# Altium project pca20017.PrjPCB
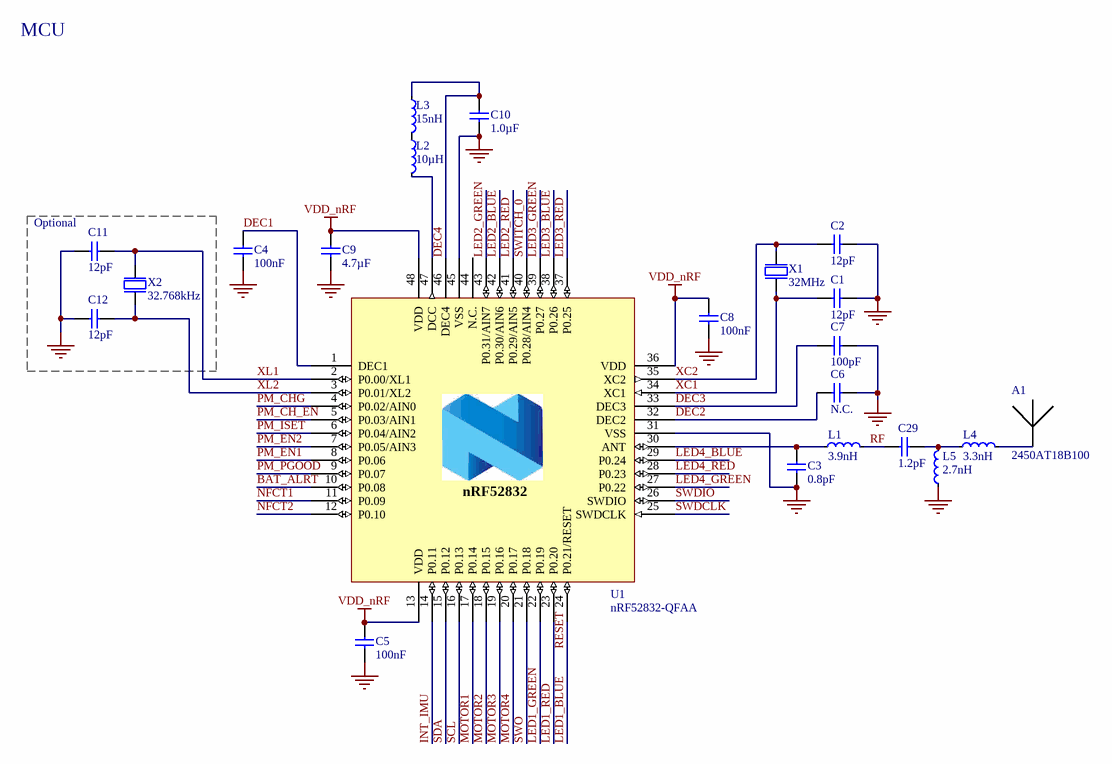
[diagram p0: pca20017_mcu.SchDoc]
5 sheets, 144 parts. Net scope: global (net labels, ports and power ports of the same name join across sheets).
Board file: 400151.PcbDoc
Sheets:
  pca20017_mcu.SchDoc
  pca20017_misc.SchDoc
  pca20017_sensors.SchDoc
  pca20017_power.SchDoc
  pca20017_motors.SchDoc

## Sheet pca20017_mcu.SchDoc: nRF52 Quadcopter - MCU
size A4; Organization: Nordic Semiconductor; DocumentNumber: 1; Revision: 1.0.0; SheetNumber: 1; SheetTotal: 5; CompanyName: Nordic Semiconductor; DrawnBy: ERHE; ProjectNumber: 4425; DocumentSize: A4; PCBRevision: 0002ERHE; PCAName: PCA20017; PCBNumber: 400151; Rule: PcbType=ProtelPcb

### Parts
A1  2450AT18B100  [2450AT18B100]
C1  12pF  [CAPC1005X04L]
C2  12pF  [CAPC1005X04L]
C3  0.8pF  [CAPC1005X04L]
C4  100nF  [CAPC1005X04L]
C5  100nF  [CAPC1005X04L]
C6  N.C.  [CAPC1005X04L]
C7  100pF  [CAPC1005X04L]
C8  100nF  [CAPC1005X04L]
C9  4.7µF  [CAPC1608X06L]
C10  1.0µF  [CAPC1608X06L]
C11  12pF  [CAPC1005X04L]
C12  12pF  [CAPC1005X04L]
C29  1.2pF  [CAPC1005X04L]
L1  3.9nH  [INDC1005X04L]
L2  10µH  [INDC1608X06L]
L3  15nH  [INDC1005X04L]
L4  3.3nH  [INDC1005X04L]
L5  2.7nH  [INDC1005X04L]
U1  nRF52832-QFAA  [QFN40P600X600X90-48N]
X1  32MHz  [BT-XTAL_2016]
X2  32.768kHz  [XTAL_3215]

### Nets
GND: C1.2 C2.2 C3.1 C4.2 C5.2 C6.1 C7.2 C8.2 C9.2 C10.1 C11.2 C12.2 L5.1 U1.31(VSS) U1.45(VSS) U1.49(GND) X1.2(GND) X1.4(GND)
VDD_nRF: C5.1 C8.1 C9.1 U1.13(VDD) U1.36(VDD) U1.48(VDD)
BAT_ALRT: U1.10(P0.08)
DEC1: C4.1 U1.1(DEC1)
DEC2: C6.2 U1.32(DEC2)
DEC3: C7.1 U1.33(DEC3)
DEC4: C10.2 L3.1 U1.46(DEC4)
INT_IMU: U1.14(P0.11)
LED1_BLUE: U1.24(P0.21/RESET)  [also labelled RESET]
LED1_GREEN: U1.22(P0.19)
LED1_RED: U1.23(P0.20)
LED2_BLUE: U1.42(P0.30/AIN6)
LED2_GREEN: U1.43(P0.31/AIN7)
LED2_RED: U1.41(P0.29/AIN5)
LED3_BLUE: U1.38(P0.26)
LED3_GREEN: U1.39(P0.27)
LED3_RED: U1.37(P0.25)
LED4_BLUE: U1.29(P0.24)
LED4_GREEN: U1.27(P0.22)
LED4_RED: U1.28(P0.23)
MOTOR1: U1.17(P0.14)
MOTOR2: U1.18(P0.15)
MOTOR3: U1.19(P0.16)
MOTOR4: U1.20(P0.17)
NFCT1: U1.11(P0.09)  [project net NFC1]
NFCT2: U1.12(P0.10)  [project net NFC2]
PM_CH_EN: U1.5(P0.03/AIN1)
PM_CHG: U1.4(P0.02/AIN0)
PM_EN1: U1.8(P0.06)
PM_EN2: U1.7(P0.05/AIN3)
PM_ISET: U1.6(P0.04/AIN2)
PM_PGOOD: U1.9(P0.07)
RF: C29.1 L1.2
SCL: U1.16(P0.13)
SDA: U1.15(P0.12)
SWDCLK: U1.25(SWDCLK)
SWDIO: U1.26(SWDIO)
SWITCH_0: U1.40(P0.28/AIN4)
SWO: U1.21(P0.18)
XC1: C1.1 U1.34(XC1) X1.1(inp)
XC2: C2.1 U1.35(XC2) X1.3(out)
XL1: C11.1 U1.2(P0.00/XL1) X2.1(inp)
XL2: C12.1 U1.3(P0.01/XL2) X2.2(out)
NetA1_1: A1.1 L4.2
NetC3_2: C3.2 L1.1 U1.30(ANT)
NetC29_2: C29.2 L4.1 L5.2
NetL2_1: L2.1 L3.2
NetL2_2: L2.2 U1.47(DCC)

Not connected (* = marked no-connect by the designer): U1 44(N.C.)

### Notes on the sheet
- MCU
- (near C11) Optional
- Title
- Size
- Date:
- Project Number
- Sheet         of
- Revision
- File:
- Drawn By:
- (in symbol nRF52832-QFAA) nRF52832

### Library data of the parts
A1 = Johanson 2450AT18B100: 2.45 GHz chip antenna; Manufacturer: Johanson Technology; Artikkelnr Noca: N.A.; Part Number: Johanson 2450AT18B100; Manufacturer Part Number: 2450AT18B100; Datasheet: http://www.johansontechnology.com/datasheets/antennas/2450AT18B100.pdf; Footprint Doc: 2450AT18B100; LatestRevisionDate: 2013-09-13; Pin Count: 2; Publisher: Nordic Semiconductor; Published: 2013-09-13; Value: 2450AT18B100; Note: *; Supplier: Digi-Key; Supplier part number: 712-1006-1-ND; 2nd source Supplier: *; 2nd source part number: *; Artikkelnr Simpro: N.A.
C1 C2 C11 C12 = C0402-12p: Capacitor, NP0, ±2%; Note: 50V; Artikkelnr Noca: 20029159; Artikkelnr Simpro: N.A.; Part Number: C0402-12p; Manufacturer: *; Manufacturer Part Number: *; Datasheet: *; LatestRevisionDate: 2011-05-11; Pin Count: 2; Publisher: Nordic Semiconductor; Published: 2009-05-08; Value: 12pF; Supplier: *; Supplier part number: *; 2nd source Supplier: *; 2nd source part number: *; Footprint Doc: 0402
C3 = C0402-0.8p: Capacitor, NP0, ±5%; Note: 50V; Artikkelnr Noca: 20029147; Artikkelnr Simpro: N.A.; Part Number: C0402-0.8p; Manufacturer: *; Manufacturer Part Number: *; Datasheet: *; LatestRevisionDate: 2012-11-21; Pin Count: 2; Publisher: Nordic Semiconductor; Published: 2009-05-08; Value: 0.8pF; Supplier: *; Supplier part number: *; 2nd source Supplier: *; 2nd source part number: *; Footprint Doc: 0402
C4 C5 C8 = C0402-100n: Capacitor, X7R, ±10%; Note: 16V; Artikkelnr Noca: 20039200; Artikkelnr Simpro: N.A.; Part Number: C0402-100n; Manufacturer: *; Manufacturer Part Number: *; Datasheet: *; LatestRevisionDate: 2009-11-23; Pin Count: 2; Publisher: Nordic Semiconductor; Published: 2009-05-08; Value: 100nF; Supplier: *; Supplier part number: *; 2nd source Supplier: *; 2nd source part number: *; Footprint Doc: 0402
C6 = C0402-N.C.: Not mounted; Note: Chip Cap; Artikkelnr Noca: N.A.; Assembly: Not mounted; Part Number: C0402-N.C.; Manufacturer: *; Manufacturer Part Number: *; Datasheet: *; LatestRevisionDate: 2009-05-08; Pin Count: 2; Publisher: Nordic Semiconductor; Published: 2009-05-08; Value: N.C.; Supplier: *; Supplier part number: *; 2nd source Supplier: *; 2nd source part number: *; Footprint Doc: 0402; Artikkelnr Simpro: N.A.
C7 = C0402-100p: Capacitor, NP0, ±5%; Note: 50V; Artikkelnr Noca: 20029135; Artikkelnr Simpro: N.A.; Part Number: C0402-100p; Manufacturer: *; Manufacturer Part Number: *; Datasheet: *; LatestRevisionDate: 2009-05-08; Pin Count: 2; Publisher: Nordic Semiconductor; Published: 2009-05-08; Value: 100pF; Supplier: *; Supplier part number: *; 2nd source Supplier: *; 2nd source part number: *; Footprint Doc: 0402
C9 = C0603-4µ7: Capacitor, X5R, ±10%; Note: 6.3V; Artikkelnr Noca: 20069060; Artikkelnr Simpro: N.A.; Part Number: C0603-4µ7; Manufacturer: *; Manufacturer Part Number: *; Datasheet: *; LatestRevisionDate: 2009-11-23; Pin Count: 2; Publisher: Nordic Semiconductor; Published: 2009-05-08; Value: 4.7µF; Supplier: *; Supplier part number: *; 2nd source Supplier: *; 2nd source part number: *; Footprint Doc: 0603
C10 = C0603-1µ0: Capacitor, X7R, ±10%; Note: 16V; Artikkelnr Noca: 20039335; Artikkelnr Simpro: N.A.; Part Number: C0603-1µ0; Manufacturer: *; Manufacturer Part Number: *; Datasheet: *; LatestRevisionDate: 2013-06-05; Pin Count: 2; Publisher: Nordic Semiconductor; Published: 2009-05-08; Value: 1.0µF; Supplier: *; Supplier part number: *; 2nd source Supplier: *; 2nd source part number: *; Footprint Doc: 0603
C29 = C0402-1.2p: Capacitor, NP0, ±0.1pF; Note: 50V; Artikkelnr Noca: 20029157; Artikkelnr Simpro: N.A.; Part Number: C0402-1.2p; Manufacturer: *; Manufacturer Part Number: *; Datasheet: *; Footprint Doc: 0402; LatestRevisionDate: 2011-05-11; Pin Count: 2; Publisher: Nordic Semiconductor; Published: 2009-05-08; Value: 1.2pF; Supplier: *; Supplier part number: *; 2nd source Supplier: *; 2nd source part number: *
L1 = L0402-3n9: Inductor, 170mA, ±0.1nH; Manufacturer: Murata; Manufacturer Part Number: LQP15MN3N9B02D; Note: High frequency chip inductor ±5%; Artikkelnr Noca: 33029151; Artikkelnr Simpro: N.A.; Part Number: L0402-3n9; Datasheet: http://search.murata.co.jp/Ceramy/image/img/PDF/ENG/L0075S0084LQP15M.pdf; LatestRevisionDate: 2012-09-19; Pin Count: 2; Publisher: Nordic Semiconductor; Published: 2009-05-08; Value: 3.9nH; Supplier: Digi-Key; Supplier part number: 490-1131-1-ND; 2nd source Supplier: *; 2nd source part number: *; Footprint Doc: 0402
L2 = L0603-10µ: Inductor, 80mA, ±10%; Manufacturer: Taiyo Yuden; Manufacturer Part Number: LBMF1608T100K; 2nd source part number: 178-6105; Note: LBMF1608T100K 10µH 80mA 0603; Artikkelnr Noca: 33029314; Artikkelnr Simpro: N.A.; Part Number: L0603-10µ; Datasheet: http://www.yuden.co.jp/ut/product/pdf/elb2_e.pdf; LatestRevisionDate: 2012-09-19; Pin Count: 2; Publisher: Nordic Semiconductor; Published: 2010-02-24; Value: 10µH; Supplier: Digi-Key; Supplier part number: 587-1714-1-ND; 2nd source Supplier: Farnell; Footprint Doc: 0603
L3 = L0402-15n: Inductor, 320mA, ±5%; Manufacturer: Taiyo Yuden; Manufacturer Part Number: HK100515NJ-T; 2nd source part number: 658-1328; Note: High frequency chip inductor ±10%; Artikkelnr Noca: 33029323; Artikkelnr Simpro: N.A.; Part Number: L0402-15n; LatestRevisionDate: 2012-09-19; Pin Count: 2; Publisher: Nordic Semiconductor; Published: 2010-07-12; Value: 15nH; Supplier: Digi-Key; Datasheet: http://www.yuden.co.jp/productdata/catalog/en/mlci04_e.pdf; Supplier part number: 587-1521-1-ND; 2nd source Supplier: Farnell; Footprint Doc: 0402
L4 = L0402-3n3: Inductor, 190mA, ±0.1nH; Manufacturer: Murata; Manufacturer Part Number: LQP15MN3N3B02D; Note: High frequency chip inductor ±5%; Artikkelnr Noca: 33029369; Artikkelnr Simpro: N.A.; Part Number: L0402-3n3; Datasheet: http://search.murata.co.jp/Ceramy/image/img/PDF/ENG/L0075S0084LQP15M.pdf; Footprint Doc: 0402; LatestRevisionDate: 2012-09-19; Pin Count: 2; Publisher: Nordic Semiconductor; Published: 2009-05-08; Value: 3.3nH; Supplier: Digi-Key; Supplier part number: 490-1130-1-ND; 2nd source Supplier: *; 2nd source part number: *
L5 = L0402-2n7: Inductor, 220mA, ±0.1nH; Manufacturer: Murata; Manufacturer Part Number: LQP15MN2N7B02D; Note: High frequency chip inductor ±5%; Artikkelnr Noca: 33029150; Artikkelnr Simpro: N.A.; Part Number: L0402-2n7; Datasheet: http://search.murata.co.jp/Ceramy/image/img/PDF/ENG/L0075S0084LQP15M.pdf; Footprint Doc: 0402; LatestRevisionDate: 2012-09-19; Pin Count: 2; Publisher: Nordic Semiconductor; Published: 2009-05-08; Value: 2.7nH; Supplier: Digi-Key; Supplier part number: 490-1129-1-ND; 2nd source Supplier: *; 2nd source part number: *
U1 = nRF52832-QFAA: Multi-protocol Bluetooth Low Energy, ANT and 2.4GHz proprietary system-on-chip; Manufacturer: Nordic Semiconductor; Artikkelnr Noca: 15079306; Artikkelnr Simpro: N.A.; Part Number: nRF52832-QFAA; Manufacturer Part Number: nRF52832-QFAA; Datasheet: *; LatestRevisionDate: 2016-06-02; Pin Count: 48; Publisher: Nordic Semiconductor; Published: 2014-11-26; Value: nRF52832-QFAA; Note: *; Supplier: Nordic Semiconductor; Supplier part number: *; 2nd source Supplier: *; 2nd source part number: *; Footprint Doc: QFN-48
X1 = XTAL_SMD2016_32MHz_8pF_Kyocera: XTAL SMD 2016, 32MHz, Cl=8pF, Tot: ±40ppm; Manufacturer Part Number: CX2016DB32000D0WZRC1; Note: XTAL SMD 32.000MHz; Artikkelnr Noca: 22010022; Artikkelnr Simpro: N.A.; Part Number: XTAL_SMD2016_32MHz_8pF_Kyocera; Manufacturer: Kyocera; Datasheet: http://media.digikey.com/pdf/Data%20Sheets/AVX%20PDFs/CX2016DB32000D0WZRC1_Spec.pdf; LatestRevisionDate: 2016-06-02; Pin Count: 4; Publisher: Nordic Semiconductor; Published: 2015-10-15; Value: 32MHz; Supplier: Digi-Key; Supplier part number: 1253-1586-1-ND; 2nd source Supplier: *; 2nd source part number: *; Footprint Doc: XTAL_2016
X2 = XTAL_SMD3215_32.768kHz_9pF_Seiko: XTAL SMD 2012, 32.768kHz, 9pF, ±20ppm; Manufacturer: Seiko; Manufacturer Part Number: SC32S-9.0PF20PPM; Note: XTAL SMD 32.768kHz, 3215; Artikkelnr Noca: N.A.; Part Number: XTAL_SMD3215_32.768kHz_9pF_Seiko; Datasheet: http://www.sii.co.jp/en/quartz/files/2013/03/file_PRODUCT_MASTER_50812_GRAPHIC03.pdf; LatestRevisionDate: 2015-10-15; Pin Count: 2; Publisher: Nordic Semiconductor; Published: 2015-10-15; Value: 32.768kHz; Supplier: *; Supplier part number: *; 2nd source Supplier: *; 2nd source part number: *; Footprint Doc: XTAL_3215; Artikkelnr Simpro: N.A.

## Sheet pca20017_misc.SchDoc: nRF52 Quadcopter - Misc
size A4; Organization: Nordic Semiconductor; DocumentNumber: 2; Revision: 1.0.0; SheetNumber: 2; SheetTotal: 5; CompanyName: Nordic Semiconductor; DrawnBy: ERHE; ProjectNumber: 4425; DocumentSize: A4; PCBRevision: 0002ERHE; PCAName: PCA20017; PCBNumber: 400151; Rule: PcbType=ProtelPcb
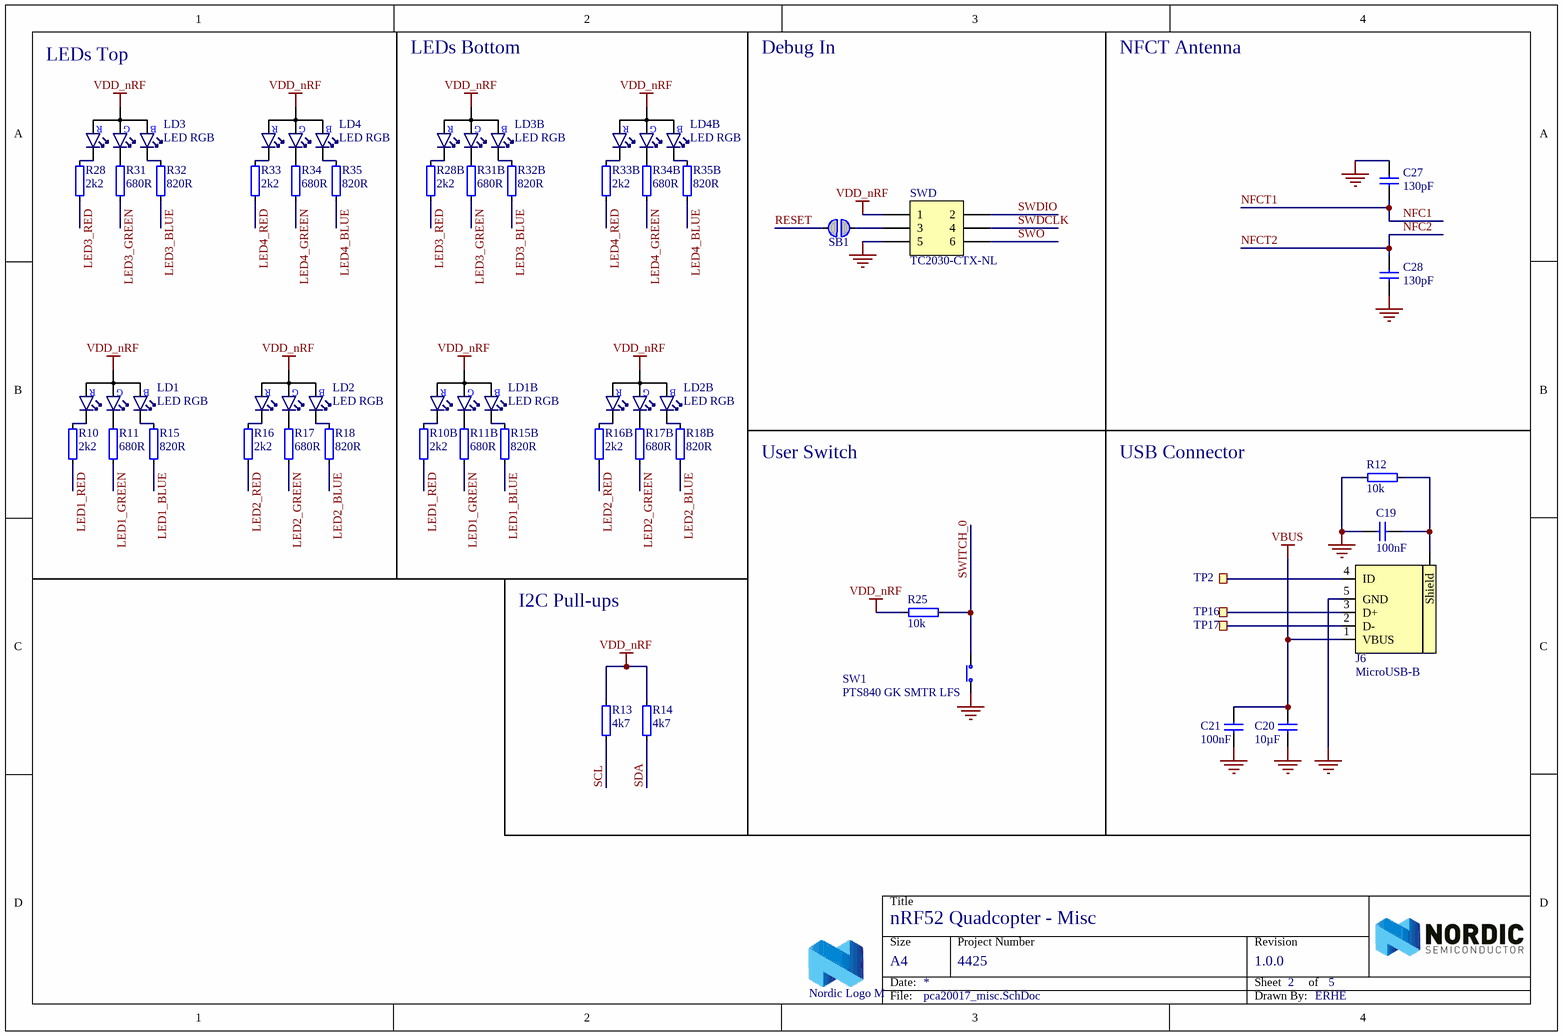
[diagram p1: pca20017_misc.SchDoc]

### Parts
C19  100nF  [CAPC1005X04L]
C20  10µF  [CAPC1608X06L]
C21  100nF  [CAPC1005X04L]
C27  130pF  [CAPC1005X04L]
C28  130pF  [CAPC1005X04L]
J6  MicroUSB-B  [USB-Micro-B-RA-SMD-PiP]
LD1  LED RGB  [SML-LX0404SIUPGUSB]
LD1B  LED RGB  [SML-LX0404SIUPGUSB]
LD2  LED RGB  [SML-LX0404SIUPGUSB]
LD2B  LED RGB  [SML-LX0404SIUPGUSB]
LD3  LED RGB  [SML-LX0404SIUPGUSB]
LD3B  LED RGB  [SML-LX0404SIUPGUSB]
LD4  LED RGB  [SML-LX0404SIUPGUSB]
LD4B  LED RGB  [SML-LX0404SIUPGUSB]
LOGO1  Nordic Logo M  [NORDIC_LOGO_M]  (no BOM)
R10  2k2  [RESC1005X04L]
R10B  2k2  [RESC1005X04L]
R11  680R  [RESC1005X04L]
R11B  680R  [RESC1005X04L]
R12  10k  [RESC1005X04L]
R13  4k7  [RESC1005X04L]
R14  4k7  [RESC1005X04L]
R15  820R  [RESC1005X04L]
R15B  820R  [RESC1005X04L]
R16  2k2  [RESC1005X04L]
R16B  2k2  [RESC1005X04L]
R17  680R  [RESC1005X04L]
R17B  680R  [RESC1005X04L]
R18  820R  [RESC1005X04L]
R18B  820R  [RESC1005X04L]
R25  10k  [RESC1005X04L]
R28  2k2  [RESC1005X04L]
R28B  2k2  [RESC1005X04L]
R31  680R  [RESC1005X04L]
R31B  680R  [RESC1005X04L]
R32  820R  [RESC1005X04L]
R32B  820R  [RESC1005X04L]
R33  2k2  [RESC1005X04L]
R33B  2k2  [RESC1005X04L]
R34  680R  [RESC1005X04L]
R34B  680R  [RESC1005X04L]
R35  820R  [RESC1005X04L]
R35B  820R  [RESC1005X04L]
SB1  Solderbridge  [Solderbridge]  (value not drawn)  (no BOM)
SW1  PTS840 GK SMTR LFS  [EVQP7A/J/B/K]
SWD  TC2030-CTX-NL  [TC2030-IDC-NLFP]  (no BOM)
TP2  Ø1.0mm,SMD  [TP_SMD_Ø1.0mm]  (value not drawn)  (no BOM)
TP16  Ø1.0mm,SMD  [TP_SMD_Ø1.0mm]  (value not drawn)  (no BOM)
TP17  Ø1.0mm,SMD  [TP_SMD_Ø1.0mm]  (value not drawn)  (no BOM)

### Nets
GND: C19.1 C20.1 C21.1 C27.2 C28.1 J6.5(GND) R12.1 SW1.2(COM) SWD.5
VBUS: C20.2 C21.2 J6.1(VBUS)
VDD_nRF: LD1.4(A) LD1B.4(A) LD2.4(A) LD2B.4(A) LD3.4(A) LD3B.4(A) LD4.4(A) LD4B.4(A) R13.2 R14.2 R25.1 SWD.1
LED1_BLUE: R15.1 R15B.1 SB1.2  [also labelled RESET]
LED1_GREEN: R11.1 R11B.1
LED1_RED: R10.1 R10B.1
LED2_BLUE: R18.1 R18B.1
LED2_GREEN: R17.1 R17B.1
LED2_RED: R16.1 R16B.1
LED3_BLUE: R32.1 R32B.1
LED3_GREEN: R31.1 R31B.1
LED3_RED: R28.1 R28B.1
LED4_BLUE: R35.1 R35B.1
LED4_GREEN: R34.1 R34B.1
LED4_RED: R33.1 R33B.1
NFC1: C27.1  [also labelled NFCT1]
NFC2: C28.2  [also labelled NFCT2]
SCL: R13.1
SDA: R14.1
SWDCLK: SWD.4
SWDIO: SWD.2
SWITCH_0: R25.2 SW1.1(N.O)
SWO: SWD.6
NetC19_2: C19.2 J6.6(Shield) R12.2
NetJ6_2: J6.2(D-) TP17.1
NetJ6_3: J6.3(D+) TP16.1
NetJ6_4: J6.4(ID) TP2.1
NetLD1_1: LD1.1(C_RED) R10.2
NetLD1_2: LD1.2(C_GREEN) R11.2
NetLD1_3: LD1.3(C_BLUE) R15.2
NetLD1B_1: LD1B.1(C_RED) R10B.2
NetLD1B_2: LD1B.2(C_GREEN) R11B.2
NetLD1B_3: LD1B.3(C_BLUE) R15B.2
NetLD2_1: LD2.1(C_RED) R16.2
NetLD2_2: LD2.2(C_GREEN) R17.2
NetLD2_3: LD2.3(C_BLUE) R18.2
NetLD2B_1: LD2B.1(C_RED) R16B.2
NetLD2B_2: LD2B.2(C_GREEN) R17B.2
NetLD2B_3: LD2B.3(C_BLUE) R18B.2
NetLD3_1: LD3.1(C_RED) R28.2
NetLD3_2: LD3.2(C_GREEN) R31.2
NetLD3_3: LD3.3(C_BLUE) R32.2
NetLD3B_1: LD3B.1(C_RED) R28B.2
NetLD3B_2: LD3B.2(C_GREEN) R31B.2
NetLD3B_3: LD3B.3(C_BLUE) R32B.2
NetLD4_1: LD4.1(C_RED) R33.2
NetLD4_2: LD4.2(C_GREEN) R34.2
NetLD4_3: LD4.3(C_BLUE) R35.2
NetLD4B_1: LD4B.1(C_RED) R33B.2
NetLD4B_2: LD4B.2(C_GREEN) R34B.2
NetLD4B_3: LD4B.3(C_BLUE) R35B.2
NetSB1_1: SB1.1 SWD.3

### Notes on the sheet
- LEDs Top
- LEDs Bottom
- Debug In
- NFCT Antenna
- User Switch
- USB Connector
- I2C Pull-ups
- Title
- Size
- Date:
- Project Number
- Sheet         of
- Revision
- File:
- Drawn By:
- (in symbol SML-LX0404SIUPGUSB) R; G; B

### Library data of the parts
C19 C21 = C0402-100n: as C4 on sheet pca20017_mcu; Part Number: C0402-100n; Manufacturer: *; Manufacturer Part Number: *; Datasheet: *; LatestRevisionDate: 2009-11-23; Pin Count: 2; Publisher: Nordic Semiconductor; Published: 2009-05-08; Value: 100nF; Supplier: *; Supplier part number: *; 2nd source Supplier: *; 2nd source part number: *; Footprint Doc: 0402
C20 = C0603-10µ: Capacitor, X5R, ±20%; Note: 6.3V; Artikkelnr Noca: 20039234; Artikkelnr Simpro: N.A.; Part Number: C0603-10µ; Manufacturer: *; Manufacturer Part Number: *; Datasheet: *; LatestRevisionDate: 2011-01-17; Pin Count: 2; Publisher: Nordic Semiconductor; Published: 2011-01-17; Value: 10µF; Supplier: *; Supplier part number: *; 2nd source Supplier: *; 2nd source part number: *; Footprint Doc: 0603
C27 C28 = C0402-130p: Chip Cap 0402; Note: Chip Cap 1%; Artikkelnr Noca: N.A.; Part Number: C0402-130p; Manufacturer: *; Manufacturer Part Number: *; Datasheet: *; Footprint Doc: 0402; LatestRevisionDate: 2015-04-24; Pin Count: 2; Publisher: Nordic Semiconductor; Published: 2015-04-24; Value: 130pF; Supplier: *; Supplier part number: *; 2nd source Supplier: *; 2nd source part number: *; Artikkelnr Simpro: N.A.
J6 = USB-Micro-B-RA-SMD-PiP: MicroUSB-B-SMT; Manufacturer: Allen Creations Corp.; Manufacturer Part Number: AJU55-BS2111-L; 2nd source part number: 609-4616-1-ND; Artikkelnr Noca: 55029020; Artikkelnr Simpro: N.A.; Part Number: USB-Micro-B-RA-SMD-PiP; Datasheet: \\hizz\pro\app9717\Datasheet\connectores\Allen Creations Corp\AJU-211.pdf; Footprint Doc: USB-Micro-B-RA-SMD-PiP; LatestRevisionDate: 2016-04-21; Pin Count: 5; Publisher: Nordic Semiconductor; Published: 2014-10-07; Value: MicroUSB-B; Note: *; Supplier: Cabcon; Supplier part number: AJU55-BS2111-L; 2nd source Supplier: Digi-Key
LD1 LD1B LD2 LD2B LD3 LD3B LD4 LD4B = SML-LX0404SIUPGUSB: RGB LED 1.00 mm x 1.00 mm SMD; Manufacturer: Lumex; 2nd source part number: 211-8843; Artikkelnr Noca: 13019150; Artikkelnr Simpro: N.A.; Part Number: SML-LX0404SIUPGUSB; Manufacturer Part Number: SML-LX0404SIUPGUSB; Datasheet: http://media.digikey.com/pdf/Data%20Sheets/Lumex%20PDFs/SML-LX0404SIUPGUSB.pdf; Footprint Doc: SML-LX0404SIUPGUSB; LatestRevisionDate: 2012-10-08; Pin Count: 4; Publisher: Nordic Semiconductor; Published: 2012-10-08; Value: LED RGB; Note: *; Supplier: Digi-Key; Supplier part number: 67-2125-1-ND; 2nd source Supplier: Farnell
LOGO1 = Nordic Logo M: Nordic Logo, medium size; Artikkelnr Noca: N.A.; Part Number: Nordic Logo M; Manufacturer: *; Manufacturer Part Number: *; Datasheet: *; LatestRevisionDate: 2010-02-18; Publisher: Nordic Semiconductor; Value: Nordic Logo M; Note: *; Supplier: *; Supplier part number: *; 2nd source Supplier: *; 2nd source part number: *; Pin Count: 2; Published: 2010-02-18; Footprint Doc: NORDIC_LOGO_M; Artikkelnr Simpro: N.A.
R10 R10B R16 R16B R28 R28B R33 R33B = R0402-2k2: Resistor, ±1%, 0.063W; Note: Chip Res 1%; Artikkelnr Noca: 27049081; Artikkelnr Simpro: N.A.; Value Ohm: 2200; Part Number: R0402-2k2; Manufacturer: *; Manufacturer Part Number: *; Datasheet: *; Footprint Doc: 0402; LatestRevisionDate: 2009-11-23; Pin Count: 2; Publisher: Nordic Semiconductor; Published: 2009-05-08; Value: 2k2; Supplier: Farnell; Supplier part number: 173-8854; 2nd source Supplier: *; 2nd source part number: *
R11 R11B R17 R17B R31 R31B R34 R34B = R0402-680: Resistor, ±1%, 0.063W; Note: Chip Res 1%; Artikkelnr Noca: 27049069; Artikkelnr Simpro: N.A.; Value Ohm: 680; Part Number: R0402-680; Manufacturer: *; Manufacturer Part Number: *; Datasheet: *; Footprint Doc: 0402; LatestRevisionDate: 2009-11-23; Pin Count: 2; Publisher: Nordic Semiconductor; Published: 2009-05-08; Value: 680R; Supplier: Farnell; Supplier part number: 173-8848; 2nd source Supplier: *; 2nd source part number: *
R12 R25 = R0402-10k: Resistor, ±1%, 0.063W; Note: Chip Res 1%; Artikkelnr Noca: 27049097; Artikkelnr Simpro: N.A.; Value Ohm: 10000; Value: 10k; Part Number: R0402-10k; Manufacturer: *; Manufacturer Part Number: *; Datasheet: *; LatestRevisionDate: 2009-11-23; Pin Count: 2; Publisher: Nordic Semiconductor; Published: 2009-05-08; Supplier: Farnell; Supplier part number: 173-8864; 2nd source Supplier: *; 2nd source part number: *; Footprint Doc: 0402
R13 R14 = R0402-4k7: Resistor, ±1%, 0.063W; Note: Chip Res 1%; Artikkelnr Noca: 27049089; Artikkelnr Simpro: N.A.; Value Ohm: 4700; Part Number: R0402-4k7; Manufacturer: *; Manufacturer Part Number: *; Datasheet: *; Footprint Doc: 0402; LatestRevisionDate: 2009-11-23; Pin Count: 2; Publisher: Nordic Semiconductor; Published: 2009-05-08; Value: 4k7; Supplier: Farnell; Supplier part number: 173-8858; 2nd source Supplier: *; 2nd source part number: *
R15 R15B R18 R18B R32 R32B R35 R35B = R0402-820: Resistor, ±1%, 0.063W; Note: Chip Res 1%; Artikkelnr Noca: 27049071; Artikkelnr Simpro: N.A.; Value Ohm: 820; Part Number: R0402-820; Manufacturer: *; Manufacturer Part Number: *; Datasheet: *; Footprint Doc: 0402; LatestRevisionDate: 2009-11-23; Pin Count: 2; Publisher: Nordic Semiconductor; Published: 2009-05-08; Value: 820R; Supplier: Farnell; Supplier part number: 173-8849; 2nd source Supplier: *; 2nd source part number: *
SB1 = Solderbridge: Artikkelnr Noca: N.A.; Part Number: Solderbridge; Manufacturer: *; Manufacturer Part Number: *; Datasheet: *; Footprint Doc: Solderbridge; LatestRevisionDate: 2009-12-14; Pin Count: 2; Publisher: Nordic Semiconductor; Published: 2009-12-14; Value: Solderbridge; Note: *; Supplier: *; Supplier part number: *; 2nd source Supplier: *; 2nd source part number: *; Artikkelnr Simpro: N.A.
SW1 = PTS840 GK SMTR LFS: Microminiature SMT Switch, Side Actuated; Manufacturer: C & K; 2nd source part number: 611-PTS840GKSMTR; Note: Tactile Switch, SPST, SMD, 220gf; Artikkelnr Noca: 50019089; Artikkelnr Simpro: N.A.; Part Number: PTS840 GK SMTR LFS; Manufacturer Part Number: PTS840 GK SMTR LFS; Datasheet: http://www.ck-components.com/80185/pts840_11june13.pdf/; Footprint Doc: PTS840 Gx; LatestRevisionDate: 2014-09-17; Pin Count: 4; Publisher: Nordic Semiconductor; Published: 2014-08-12; Value: PTS840 GK SMTR LFS; Supplier: Digi-Key; Supplier part number: CKN10508CT-ND; 2nd source Supplier: Mouser
SWD = TC2030-CTX-NL: CBL PLUG-OF-NAILS 6-PIN; Manufacturer: Tag-Connect LLC; Artikkelnr Noca: N.A.; Part Number: TC2030-CTX-NL; Manufacturer Part Number: TC2030-CTX-NL; Datasheet: http://www.tag-connect.com/Materials/TC2030-IDC-NL.pdf; Footprint Doc: TC2030-IDC-NLFP; LatestRevisionDate: 2013-08-08; Pin Count: 6; Publisher: Nordic Semiconductor; Published: 2013-08-08; Value: TC2030-CTX-NL; Supplier: Tag-Connect; Supplier part number: TC2030-CTX-NL; 2nd source Supplier: *; 2nd source part number: *; Artikkelnr Simpro: N.A.
TP2 TP16 TP17 = TP_SMD_Ø1.0MM: 1.0mm circular SMD testpad; Manufacturer: Nordic Semiconductor; Artikkelnr Noca: N.A.; Part Number: TP_SMD_Ø1.0MM; Manufacturer Part Number: *; Datasheet: *; Footprint Doc: TP_SMD_Ø1.0mm; LatestRevisionDate: 2013-06-11; Pin Count: 1; Publisher: Nordic Semiconductor; Published: 2013-06-11; Value: Ø1.0mm,SMD; Note: *; Supplier: *; Supplier part number: *; 2nd source Supplier: *; 2nd source part number: *; Artikkelnr Simpro: N.A.

## Sheet pca20017_sensors.SchDoc: nRF52 Quadcopter - Sensors
size A4; Organization: Nordic Semiconductor; DocumentNumber: 3; Revision: 1.0.0; SheetNumber: 3; SheetTotal: 5; CompanyName: Nordic Semiconductor; DrawnBy: ERHE; ProjectNumber: 4425; DocumentSize: A4; PCAName: PCA20017; PCBRevision: 0002ERHE; PCBNumber: 400151; ProjectName: 4425
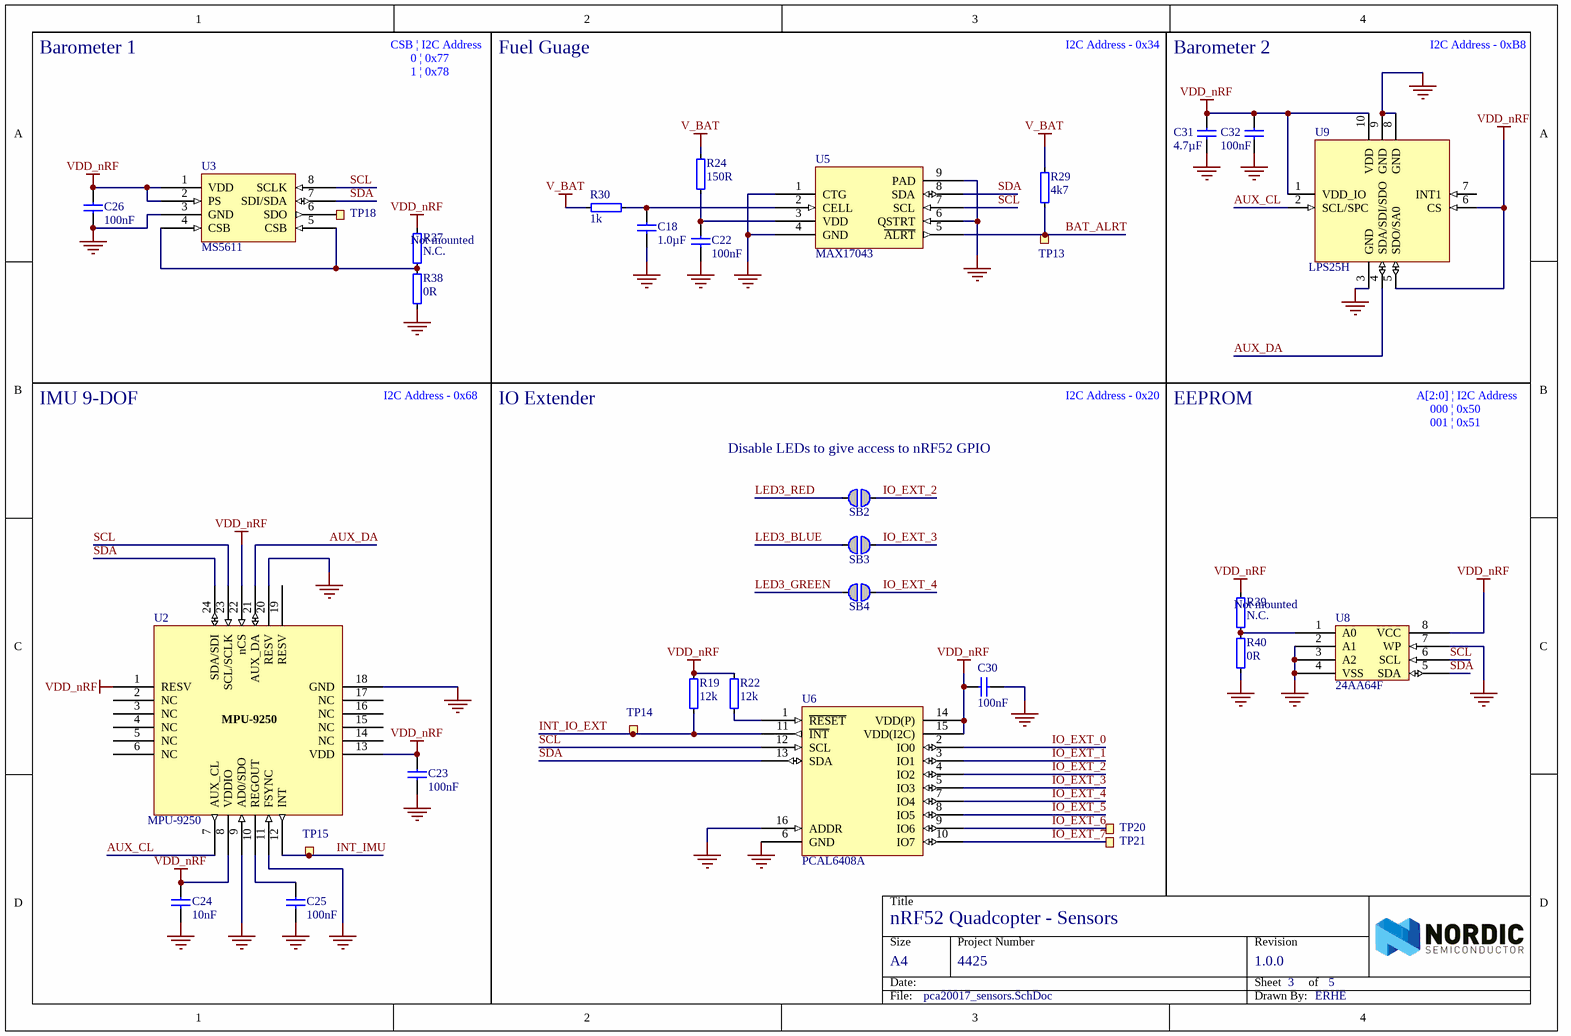
[diagram p2: pca20017_sensors.SchDoc]

### Parts
C18  1.0µF  [CAPC1005X04L]
C22  100nF  [CAPC1005X04L]
C23  100nF  [CAPC1005X04L]
C24  10nF  [CAPC1005X04L]
C25  100nF  [CAPC1005X04L]
C26  100nF  [CAPC1005X04L]
C30  100nF  [CAPC1005X04L]
C31  4.7µF  [CAPC1608X06L]
C32  100nF  [CAPC1005X04L]
R19  12k  [RESC1005X04L]
R22  12k  [RESC1005X04L]
R24  150R  [RESC1005X04L]
R29  4k7  [RESC1005X04L]
R30  1k  [RESC1005X04L]
R37  N.C.  Assembly: Not mounted  [RESC1005X04L]
R38  0R  [RESC1005X04L]
R39  N.C.  Assembly: Not mounted  [RESC1005X04L]
R40  0R  [RESC1005X04L]
SB2  Solderbridge  [Solderbridge]  (value not drawn)  (no BOM)
SB3  Solderbridge  [Solderbridge]  (value not drawn)  (no BOM)
SB4  Solderbridge  [Solderbridge]  (value not drawn)  (no BOM)
TP13  Ø1.0mm,SMD  [TP_SMD_Ø1.0mm]  (value not drawn)  (no BOM)
TP14  Ø1.0mm,SMD  [TP_SMD_Ø1.0mm]  (value not drawn)  (no BOM)
TP15  Ø1.0mm,SMD  [TP_SMD_Ø1.0mm]  (value not drawn)  (no BOM)
TP18  Ø1.0mm,SMD  [TP_SMD_Ø1.0mm]  (value not drawn)  (no BOM)
TP20  Ø1.0mm,SMD  [TP_SMD_Ø1.0mm]  (value not drawn)  (no BOM)
TP21  Ø1.0mm,SMD  [TP_SMD_Ø1.0mm]  (value not drawn)  (no BOM)
U2  MPU-9250  [QFN40P300X300X105_HS-25N]
U3  MS5611  [QFN125P300X500X100-8N]
U5  MAX17043  [MAX17043]
U6  PCAL6408A  [XQFN40P180X260X50-16N]
U8  24AA64F  [24AA64F]
U9  LPS25H  [HCLGA-10L (2.5x2.5x1.0mm)]

### Nets
GND: C18.1 C22.1 C23.1 C24.1 C25.1 C26.2 C30.1 C31.1 C32.1 R38.1 R40.1 U2.9(AD0/SDO) U2.11(FSYNC) U2.18(GND) U2.20(RESV) U3.3(GND) U5.1(CTG) U5.4(GND) U5.6(QSTRT) U5.9(PAD) U6.6(GND) U6.16(ADDR) U8.2(A1) U8.3(A2) U8.4(VSS) U8.7(WP) U9.3(GND) U9.8(GND) U9.9(GND)
V_BAT: R24.2 R29.2 R30.1
VDD_nRF: C23.2 C24.2 C26.1 C30.2 C31.2 C32.2 R19.2 R22.2 R37.2 R39.2 U2.1(RESV) U2.8(VDDIO) U2.13(VDD) U2.22(nCS) U3.1(VDD) U3.2(PS) U6.14(VDD(P)) U6.15(VDD(I2C)) U8.8(VCC) U9.1(VDD_IO) U9.5(SDO/SA0) U9.6(CS) U9.10(VDD)
AUX_CL: U2.7(AUX_CL) U9.2(SCL/SPC)
AUX_DA: U2.21(AUX_DA) U9.4(SDA/SDI/SDO)
BAT_ALRT: R29.1 TP13.1 U5.5(~{ALRT})
INT_IMU: TP15.1 U2.12(INT)
INT_IO_EXT: R19.1 TP14.1 U6.11(~{INT})
IO_EXT_0: U6.2(IO0)
IO_EXT_1: U6.3(IO1)
IO_EXT_2: SB2.2 U6.4(IO2)
IO_EXT_3: SB3.2 U6.5(IO3)
IO_EXT_4: SB4.2 U6.7(IO4)
IO_EXT_5: U6.8(IO5)
IO_EXT_6: TP20.1 U6.9(IO6)
IO_EXT_7: TP21.1 U6.10(IO7)
LED3_BLUE: SB3.1
LED3_GREEN: SB4.1
LED3_RED: SB2.1
SCL: U2.23(SCL/SCLK) U3.8(SCLK) U5.7(SCL) U6.12(SCL) U8.6(SCL)
SDA: U2.24(SDA/SDI) U3.7(SDI/SDA) U5.8(SDA) U6.13(SDA) U8.5(SDA)
NetC18_2: C18.2 R30.2 U5.2(CELL)
NetC22_2: C22.2 R24.1 U5.3(VDD)
NetC25_2: C25.2 U2.10(REGOUT)
NetR22_1: R22.1 U6.1(~{RESET})
NetR37_1: R37.1 R38.2 U3.4(CSB) U3.5(CSB)
NetR39_1: R39.1 R40.2 U8.1(A0)
NetTP18_1: TP18.1 U3.6(SDO)

Not connected (* = marked no-connect by the designer): U2 2(NC) 3(NC) 4(NC) 5(NC) 6(NC) 14(NC) 15(NC) 16(NC) 17(NC) 19(RESV); U9 7(INT1)

### Notes on the sheet
- Barometer 1
- CSB | I2C Address
- 0 | 0x77
- 1 | 0x78
- Fuel Guage
- I2C Address - 0x34
- Barometer 2
- I2C Address - 0xB8
- IMU 9-DOF
- I2C Address - 0x68
- IO Extender
- I2C Address - 0x20
- EEPROM
- A[2:0] | I2C Address
- 000 | 0x50
- 001 | 0x51
- (near SB2) Disable LEDs to give access to nRF52 GPIO
- Title
- Size
- Date:
- Project Number
- Sheet         of
- Revision
- File:
- Drawn By:

### Library data of the parts
C18 = C0402-1µ0: Capacitor, X5R, ±5%; Note: 6.3V; Artikkelnr Noca: 20039235; Artikkelnr Simpro: N.A.; Part Number: C0402-1µ0; Manufacturer: *; Manufacturer Part Number: *; Datasheet: *; Footprint Doc: 0402; LatestRevisionDate: 2009-11-23; Pin Count: 2; Publisher: Nordic Semiconductor; Published: 2009-05-08; Value: 1.0µF; Supplier: *; Supplier part number: *; 2nd source Supplier: *; 2nd source part number: *
C22 C23 C25 C26 C30 C32 = C0402-100n: as C4 on sheet pca20017_mcu; Part Number: C0402-100n; Manufacturer: *; Manufacturer Part Number: *; Datasheet: *; Footprint Doc: 0402; LatestRevisionDate: 2009-11-23; Pin Count: 2; Publisher: Nordic Semiconductor; Published: 2009-05-08; Value: 100nF; Supplier: *; Supplier part number: *; 2nd source Supplier: *; 2nd source part number: *
C24 = C0402-10n: Capacitor, X7R, ±10%; Note: 16V; Artikkelnr Noca: 20039166; Artikkelnr Simpro: N.A.; Part Number: C0402-10n; Manufacturer: *; Manufacturer Part Number: *; Datasheet: *; Footprint Doc: 0402; LatestRevisionDate: 2009-11-23; Pin Count: 2; Publisher: Nordic Semiconductor; Published: 2009-05-08; Value: 10nF; Supplier: *; Supplier part number: *; 2nd source Supplier: *; 2nd source part number: *
C31 = C0603-4µ7: as C9 on sheet pca20017_mcu; Part Number: C0603-4µ7; Manufacturer: *; Manufacturer Part Number: *; Datasheet: *; Footprint Doc: 0603; LatestRevisionDate: 2009-11-23; Pin Count: 2; Publisher: Nordic Semiconductor; Published: 2009-05-08; Value: 4.7µF; Supplier: *; Supplier part number: *; 2nd source Supplier: *; 2nd source part number: *
R19 R22 = R0402-12k: Resistor, ±1%, 0.063W; Note: Chip Res 1%; Artikkelnr Noca: 27049099; Artikkelnr Simpro: N.A.; Value Ohm: 12000; Part Number: R0402-12k; Manufacturer: *; Manufacturer Part Number: *; Datasheet: *; Footprint Doc: 0402; LatestRevisionDate: 2009-11-23; Pin Count: 2; Publisher: Nordic Semiconductor; Published: 2009-05-08; Value: 12k; Supplier: Farnell; Supplier part number: 173-8865; 2nd source Supplier: *; 2nd source part number: *
R24 = R0402-150: Resistor, ±1%, 0.063W; Note: Chip Res 1%; Artikkelnr Noca: 27049053; Artikkelnr Simpro: N.A.; Value Ohm: 150; Part Number: R0402-150; Manufacturer: *; Manufacturer Part Number: *; Datasheet: *; Footprint Doc: 0402; LatestRevisionDate: 2009-11-23; Pin Count: 2; Publisher: Nordic Semiconductor; Published: 2009-05-08; Value: 150R; Supplier: Farnell; Supplier part number: 173-8839; 2nd source Supplier: *; 2nd source part number: *
R29 = R0402-4k7: as R13 on sheet pca20017_misc; Part Number: R0402-4k7; Manufacturer: *; Manufacturer Part Number: *; Datasheet: *; Footprint Doc: 0402; LatestRevisionDate: 2009-11-23; Pin Count: 2; Publisher: Nordic Semiconductor; Published: 2009-05-08; Value: 4k7; Supplier: Farnell; Supplier part number: 173-8858; 2nd source Supplier: *; 2nd source part number: *
R30 = R0402-1k0: Resistor, ±1%, 0.063W; Note: Chip Res 1%; Artikkelnr Noca: 27049073; Artikkelnr Simpro: N.A.; Value Ohm: 1000; Part Number: R0402-1k0; Manufacturer: *; Manufacturer Part Number: *; Datasheet: *; Footprint Doc: 0402; LatestRevisionDate: 2009-11-23; Pin Count: 2; Publisher: Nordic Semiconductor; Published: 2009-05-08; Value: 1k; Supplier: Farnell; Supplier part number: 173-8850; 2nd source Supplier: *; 2nd source part number: *
R37 R39 = R0402-N.C.: Not mounted; Note: Chip Res; Artikkelnr Noca: N.A.; Part Number: R0402-N.C.; Manufacturer: *; Manufacturer Part Number: *; Datasheet: *; Footprint Doc: 0402; LatestRevisionDate: 2009-05-08; Pin Count: 2; Publisher: Nordic Semiconductor; Published: 2009-05-08; Value: N.C.; Supplier: *; Supplier part number: *; 2nd source Supplier: *; 2nd source part number: *; Artikkelnr Simpro: N.A.
R38 R40 = R0402-0R: Resistor, ±5%, 0.063W; Note: Chip Res 5%; Artikkelnr Noca: 27049000; Artikkelnr Simpro: N.A.; Value Ohm: 0; Part Number: R0402-0R; Manufacturer: *; Manufacturer Part Number: *; Datasheet: *; Footprint Doc: 0402; LatestRevisionDate: 2009-11-23; Pin Count: 2; Publisher: Nordic Semiconductor; Published: 2009-05-08; Value: 0R; Supplier: Farnell; Supplier part number: 146-9661; 2nd source Supplier: *; 2nd source part number: *
SB2-SB4 = Solderbridge: Artikkelnr Noca: N.A.; Part Number: Solderbridge; Manufacturer: *; Manufacturer Part Number: *; Datasheet: *; Footprint Doc: Solderbridge; LatestRevisionDate: 2009-12-14; Pin Count: 2; Publisher: Nordic Semiconductor; Published: 2009-12-14; Value: Solderbridge; Note: *; Supplier: *; Supplier part number: *; 2nd source Supplier: *; 2nd source part number: *; Artikkelnr Simpro: N.A.
TP13-TP15 TP18 TP20 TP21 = TP_SMD_Ø1.0MM: as TP2 on sheet pca20017_misc; Part Number: TP_SMD_Ø1.0MM; Manufacturer Part Number: *; Datasheet: *; Footprint Doc: TP_SMD_Ø1.0mm; LatestRevisionDate: 2013-06-11; Pin Count: 1; Publisher: Nordic Semiconductor; Published: 2013-06-11; Value: Ø1.0mm,SMD; Note: *; Supplier: *; Supplier part number: *; 2nd source Supplier: *; 2nd source part number: *; Artikkelnr Simpro: N.A.
U2 = MPU-9250: 9-axis MotionTracking™ Device; Manufacturer: InvenSense; Note: 3-Axis Gyro, 3-Axis Accel and 3-Axis Compass; Artikkelnr Noca: N.A.; Part Number: MPU-9250; Manufacturer Part Number: MPU-9250; Datasheet: http://43zrtwysvxb2gf29r5o0athu.wpengine.netdna-cdn.com/wp-content/uploads/2015/02/MPU-9250-Datasheet.pdf; Footprint Doc: QFN-24; LatestRevisionDate: 2015-06-24; Pin Count: 24; Publisher: Nordic Semiconductor; Published: 2015-06-24; Value: MPU-9250; Supplier: Digi-Key; Supplier part number: 1428-1019-1-ND; 2nd source Supplier: *; 2nd source part number: *; Artikkelnr Simpro: N.A.
U3 = MS5611-01BA03: Accurate Pressure/Altitude and Temperature sensor with I2C and SPI interface; Manufacturer: Measurement Specialties; Manufacturer Part Number: MS561101BA03-50; 2nd source part number: 824-MS561101BA03-50; Note: MEASUREMENT SPECIALTIES  MS561101BA03-50  SENSOR, BAROMETRIC, 0.01-1.2BAR, QFN-8; Artikkelnr Noca: N.A.; Part Number: MS5611-01BA03; Datasheet: http://www.meas-spec.com/downloads/MS5611-01BA03.pdf; Footprint Doc: QFN-8; LatestRevisionDate: 2015-06-24; Pin Count: 8; Publisher: Nordic Semiconductor; Published: 2015-06-24; Value: MS5611-01BA03; Supplier: Farnell; Supplier part number: 2362662; 2nd source Supplier: Mouser; Artikkelnr Simpro: N.A.
U5 = MAX17043: IC FUEL FUAGE LI-ION; Manufacturer: Maxim; Manufacturer Part Number: MAX17043G+U; 2nd source part number: 700-MAX17043G+U; Note: Compact, Low-Cost 1S/2S Fuel Gauges with Low-Battery Alert; Artikkelnr Noca: N.A.; Part Number: MAX17043; Datasheet: http://www.mouser.com/ds/2/256/MAX17043-MAX17044-44624.pdf; Footprint Doc: TDFN-8L-2x3mm; LatestRevisionDate: 2015-06-24; Pin Count: 8; Publisher: Nordic Semiconductor; Published: 2015-06-24; Value: MAX17043; Supplier: *; Supplier part number: *; 2nd source Supplier: Mouser; Artikkelnr Simpro: N.A.
U6 = PCAL6408AHK: 8-bit I2C-bus I/O expander with interrupt output; Manufacturer: NXP Semiconductors; 2nd source part number: 771-PCAL6408AHKX; Artikkelnr Noca: N.A.; Part Number: PCAL6408AHK; Manufacturer Part Number: PCAL6408AHK; Datasheet: http://www.nxp.com/documents/data_sheet/PCAL6408A.pdf; Footprint Doc: XQFN-16; LatestRevisionDate: 2015-04-29; Pin Count: 16; Publisher: Nordic Semiconductor; Published: 2015-04-29; Value: PCAL6408A; Note: *; Supplier: Digi-Key; Supplier part number: 568-9944-2-ND; 2nd source Supplier: Mouser; Artikkelnr Simpro: N.A.
U8 = 24AA64F: IC EEPROM 64K with I2C interface TDFN-8; Manufacturer: Microchip; Manufacturer Part Number: 24AA64T-I/MNY; Artikkelnr Noca: N.A.; Part Number: 24AA64F; Datasheet: http://ww1.microchip.com/downloads/en/DeviceDoc/21189T.pdf; Footprint Doc: TDFN-8; LatestRevisionDate: 2015-06-30; Pin Count: 8; Publisher: Nordic Semiconductor; Published: 2015-06-30; Value: 24AA64F; Note: EEPROM 64K with I2C interface; Supplier: Digi-Key; Supplier part number: 24AA64T-I/MNYCT-ND; 2nd source Supplier: *; 2nd source part number: *; Artikkelnr Simpro: N.A.
U9 = LPS25H (NRND): MEMS pressure sensor: 260-1260 hPa absolute digital output barometer; Manufacturer: STMicroelectronics; 2nd source part number: 511-LPS25HTR; Artikkelnr Noca: N.A.; Part Number: LPS25H (NRND); Manufacturer Part Number: LPS25H; Datasheet: http://www.st.com/st-web-ui/static/active/en/resource/technical/document/datasheet/DM00066332.pdf; Footprint Doc: HCLGA-10L; LatestRevisionDate: 2014-08-21; Pin Count: 10; Publisher: Nordic Semiconductor; Published: 2014-08-21; Value: LPS25H; Note: *; Supplier: Digi-Key; Supplier part number: 497-14380-1-ND; 2nd source Supplier: Mouser; Artikkelnr Simpro: N.A.

## Sheet pca20017_power.SchDoc: nRF52 Quadcopter - Power
size A4; Organization: Nordic Semiconductor; DocumentNumber: 4; Revision: 1.0.0; SheetNumber: 4; SheetTotal: 5; CompanyName: Nordic Semiconductor; DrawnBy: ERHE; ProjectNumber: 4425; DocumentSize: A4; PCAName: PCA20017; PCBRevision: 0002ERHE; PCBNumber: 400151
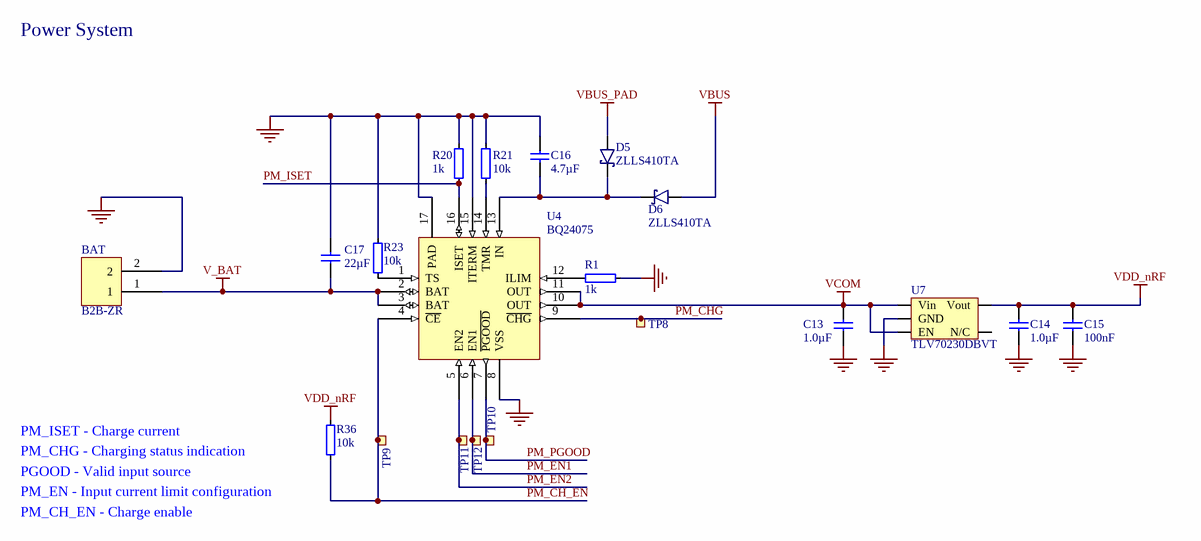
[diagram p3: pca20017_power.SchDoc]

### Parts
BAT  B2B-ZR  [B2B-ZR]
C13  1.0µF  [CAPC1005X04L]
C14  1.0µF  [CAPC1005X04L]
C15  100nF  [CAPC1005X04L]
C16  4.7µF  [CAPC1005X04L]
C17  22µF  [CAPC2012X11L]
D5  ZLLS410TA  [SOD-323]
D6  ZLLS410TA  [SOD-323]
R1  1k  [RESC1005X04L]
R20  1k  [RESC1005X04L]
R21  10k  [RESC1005X04L]
R23  10k  [RESC1005X04L]
R36  10k  [RESC1005X04L]
TP8  Ø1.0mm,SMD  [TP_SMD_Ø1.0mm]  (value not drawn)  (no BOM)
TP9  Ø1.0mm,SMD  [TP_SMD_Ø1.0mm]  (value not drawn)  (no BOM)
TP10  Ø1.0mm,SMD  [TP_SMD_Ø1.0mm]  (value not drawn)  (no BOM)
TP11  Ø1.0mm,SMD  [TP_SMD_Ø1.0mm]  (value not drawn)  (no BOM)
TP12  Ø1.0mm,SMD  [TP_SMD_Ø1.0mm]  (value not drawn)  (no BOM)
U4  BQ24075  [QFN50P300X300X100_HS-17N]
U7  TLV70230DBVT  [SOT-23-5]

### Nets
GND: BAT.2 C13.1 C14.1 C15.1 C16.2 C17.2 R1.2 R20.2 R21.2 R23.1 U4.8(VSS) U4.15(ITERM) U4.17(PAD) U7.2(GND)
V_BAT: BAT.1 C17.1 U4.2(BAT) U4.3(BAT)
VBUS: D6.1(A)
VBUS_PAD: D5.1(A)
VCOM: C13.2 U4.10(OUT) U4.11(OUT) U7.1(Vin) U7.3(EN)
VDD_nRF: C14.2 C15.2 R36.2 U7.5(Vout)
PM_CH_EN: R36.1 TP9.1 U4.4(~{CE})
PM_CHG: TP8.1 U4.9(~{CHG})
PM_EN1: TP12.1 U4.6(EN1)
PM_EN2: TP11.1 U4.5(EN2)
PM_ISET: R20.1 U4.16(ISET)
PM_PGOOD: TP10.1 U4.7(~{PGOOD})
NetC16_1: C16.1 D5.3(C) D6.3(C) U4.13(IN)
NetR1_1: R1.1 U4.12(ILIM)
NetR21_1: R21.1 U4.14(TMR)
NetR23_2: R23.2 U4.1(TS)

Not connected (* = marked no-connect by the designer): U7 4(N/C)

### Notes on the sheet
- Power System
- PM_ISET - Charge current
- PM_CHG - Charging status indication
- (near R36) PM_EN - Input current limit configuration
- PM_CH_EN - Charge enable
- PGOOD - Valid input source
- Title
- Size
- Date:
- Project Number
- Sheet         of
- Revision
- File:
- Drawn By:

### Library data of the parts
BAT = B2B-ZR: CONN JST 2POS 0.059" (1.50mm); Manufacturer: JST Sales America Inc; Manufacturer Part Number: B2B-ZR(LF)(SN); Artikkelnr Noca: N.A.; Part Number: B2B-ZR; Datasheet: http://www.jst-mfg.com/product/pdf/eng/eZH.pdf; Footprint Doc: B2B-ZR; LatestRevisionDate: 2015-07-02; Pin Count: 2; Publisher: Nordic Semiconductor; Published: 2015-07-02; Value: B2B-ZR; Note: *; Supplier: Digi-Key; Supplier part number: 455-1657-ND; 2nd source Supplier: *; 2nd source part number: *; Artikkelnr Simpro: N.A.
C13 C14 = C0402-1µ0: as C18 on sheet pca20017_sensors; Part Number: C0402-1µ0; Manufacturer: *; Manufacturer Part Number: *; Datasheet: *; Footprint Doc: 0402; LatestRevisionDate: 2009-11-23; Pin Count: 2; Publisher: Nordic Semiconductor; Published: 2009-05-08; Value: 1.0µF; Supplier: *; Supplier part number: *; 2nd source Supplier: *; 2nd source part number: *
C15 = C0402-100n: as C4 on sheet pca20017_mcu; Part Number: C0402-100n; Manufacturer: *; Manufacturer Part Number: *; Datasheet: *; Footprint Doc: 0402; LatestRevisionDate: 2009-11-23; Pin Count: 2; Publisher: Nordic Semiconductor; Published: 2009-05-08; Value: 100nF; Supplier: *; Supplier part number: *; 2nd source Supplier: *; 2nd source part number: *
C16 = C0402-4µ7: Capacitor, X5R, ±20%; Note: 10V; Artikkelnr Noca: 20039482; Artikkelnr Simpro: N.A.; Part Number: C0402-4µ7; Manufacturer: *; Manufacturer Part Number: *; Datasheet: *; Footprint Doc: 0402; LatestRevisionDate: 2016-06-02; Pin Count: 2; Publisher: Nordic Semiconductor; Published: 2009-05-08; Value: 4.7µF; Supplier: *; Supplier part number: *; 2nd source Supplier: *; 2nd source part number: *
C17 = C0805-22µ: Capacitor, X5R, ±10%; Note: 6.3V; Artikkelnr Noca: 20039330; Artikkelnr Simpro: N.A.; Part Number: C0805-22µ; Manufacturer: *; Manufacturer Part Number: *; Datasheet: *; Footprint Doc: 0805; LatestRevisionDate: 2013-06-04; Pin Count: 2; Publisher: Nordic Semiconductor; Published: 2011-01-17; Value: 22µF; Supplier: *; Supplier part number: *; 2nd source Supplier: *; 2nd source part number: *
D5 D6 = ZLLS410TA: DIODE SCHOTTKY 10V 0.57A SOD323; Manufacturer: Diodes Incorporated; 2nd source part number: 522-ZLLS410TA; Artikkelnr Noca: N.A.; Part Number: ZLLS410TA; Manufacturer Part Number: ZLLS410TA; Datasheet: http://www.diodes.com/datasheets/ZLLS410.pdf; Footprint Doc: SOD-323; LatestRevisionDate: 2014-12-11; Publisher: Nordic Semiconductor; Published: 2014-12-11; Value: ZLLS410TA; Note: *; Supplier: Digi-Key; Supplier part number: ZLLS410CT-ND; 2nd source Supplier: Mouser; Artikkelnr Simpro: N.A.
R1 R20 = R0402-1k0: as R30 on sheet pca20017_sensors; Part Number: R0402-1k0; Manufacturer: *; Manufacturer Part Number: *; Datasheet: *; Footprint Doc: 0402; LatestRevisionDate: 2009-11-23; Pin Count: 2; Publisher: Nordic Semiconductor; Published: 2009-05-08; Value: 1k; Supplier: Farnell; Supplier part number: 173-8850; 2nd source Supplier: *; 2nd source part number: *
R21 R23 R36 = R0402-10k: as R12 on sheet pca20017_misc; Part Number: R0402-10k; Manufacturer: *; Manufacturer Part Number: *; Datasheet: *; Footprint Doc: 0402; LatestRevisionDate: 2009-11-23; Pin Count: 2; Publisher: Nordic Semiconductor; Published: 2009-05-08; Value: 10k; Supplier: Farnell; Supplier part number: 173-8864; 2nd source Supplier: *; 2nd source part number: *
TP8-TP12 = TP_SMD_Ø1.0MM: as TP2 on sheet pca20017_misc; Part Number: TP_SMD_Ø1.0MM; Manufacturer Part Number: *; Datasheet: *; Footprint Doc: TP_SMD_Ø1.0mm; LatestRevisionDate: 2013-06-11; Pin Count: 1; Publisher: Nordic Semiconductor; Published: 2013-06-11; Value: Ø1.0mm,SMD; Note: *; Supplier: *; Supplier part number: *; 2nd source Supplier: *; 2nd source part number: *; Artikkelnr Simpro: N.A.
U4 = BQ24075: IC SINGLE CELL USB LI-ION CHARGER; Manufacturer: Texas Instruments; Manufacturer Part Number: BQ24075RGTT; Note: USB-Friendly Li-Ion Battery Charger and Power-Path Management IC, Vout 5.5V; Artikkelnr Noca: N.A.; Part Number: BQ24075; Datasheet: http://www.ti.com/lit/ds/symlink/bq24075.pdf; Footprint Doc: S-PVQFN-N16; LatestRevisionDate: 2015-06-24; Pin Count: 16; Publisher: Nordic Semiconductor; Published: 2015-06-24; Value: BQ24075; Supplier: Digi-Key; Supplier part number: 296-23840-1-ND; 2nd source Supplier: *; 2nd source part number: *; Artikkelnr Simpro: N.A.
U7 = TLV70230DBVT: IC REG LDO 3V 300MA SOT23-5; Manufacturer: Texas Instruments; Note: 300-mA, Low-IQ, Low-Dropout Regulator; Artikkelnr Noca: N.A.; Part Number: TLV70230DBVT; Manufacturer Part Number: TLV70230DBVT; Datasheet: http://www.ti.com/lit/ds/symlink/tlv70218.pdf; Footprint Doc: SOT-23-5; LatestRevisionDate: 2015-06-24; Pin Count: 5; Publisher: Nordic Semiconductor; Published: 2015-06-24; Value: TLV70230DBVT; Supplier: Digi-Key; Supplier part number: 296-27893-1-ND; 2nd source Supplier: *; 2nd source part number: *; Artikkelnr Simpro: N.A.

## Sheet pca20017_motors.SchDoc: nRF52 Quadcopter - Motors
size A4; Organization: Nordic Semiconductor; DocumentNumber: 5; Revision: 1.0.0; SheetNumber: 5; SheetTotal: 5; CompanyName: Nordic Semiconductor; DrawnBy: ERHE; ProjectNumber: 4425; DocumentSize: A4; PCAName: PCA20017; PCBRevision: 0002ERHE; PCBNumber: 400151
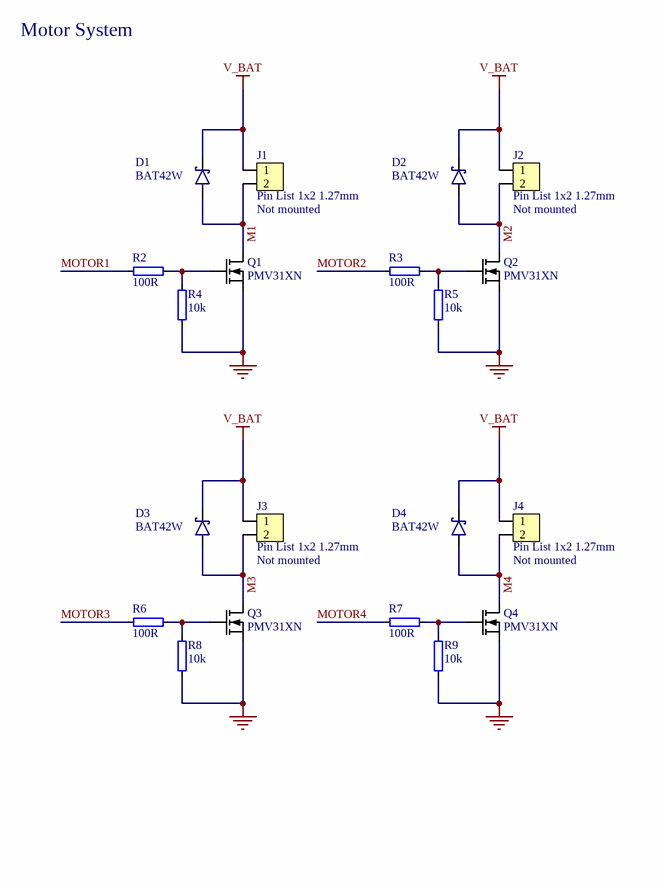
[diagram p4: pca20017_motors.SchDoc]

### Parts
D1  BAT42W  [SOD-123]
D2  BAT42W  [SOD-123]
D3  BAT42W  [SOD-123]
D4  BAT42W  [SOD-123]
J1  Pin List 1x2 1.27mm  Assembly: Not mounted  [LIST_1x2_TH_1.27mm_N.C.]
J2  Pin List 1x2 1.27mm  Assembly: Not mounted  [LIST_1x2_TH_1.27mm_N.C.]
J3  Pin List 1x2 1.27mm  Assembly: Not mounted  [LIST_1x2_TH_1.27mm_N.C.]
J4  Pin List 1x2 1.27mm  Assembly: Not mounted  [LIST_1x2_TH_1.27mm_N.C.]
Q1  PMV31XN  [SOT-23a]
Q2  PMV31XN  [SOT-23a]
Q3  PMV31XN  [SOT-23a]
Q4  PMV31XN  [SOT-23a]
R2  100R  [RESC1005X04L]
R3  100R  [RESC1005X04L]
R4  10k  [RESC1005X04L]
R5  10k  [RESC1005X04L]
R6  100R  [RESC1005X04L]
R7  100R  [RESC1005X04L]
R8  10k  [RESC1005X04L]
R9  10k  [RESC1005X04L]

### Nets
GND: Q1.2(S) Q2.2(S) Q3.2(S) Q4.2(S) R4.1 R5.1 R8.1 R9.1
V_BAT: D1.3(C) D2.3(C) D3.3(C) D4.3(C) J1.1 J2.1 J3.1 J4.1
M1: D1.1(A) J1.2 Q1.3(D)
M2: D2.1(A) J2.2 Q2.3(D)
M3: D3.1(A) J3.2 Q3.3(D)
M4: D4.1(A) J4.2 Q4.3(D)
MOTOR1: R2.1
MOTOR2: R3.1
MOTOR3: R6.1
MOTOR4: R7.1
NetQ1_1: Q1.1(G) R2.2 R4.2
NetQ2_1: Q2.1(G) R3.2 R5.2
NetQ3_1: Q3.1(G) R6.2 R8.2
NetQ4_1: Q4.1(G) R7.2 R9.2

### Notes on the sheet
- Motor System
- Title
- Size
- Date:
- Project Number
- Sheet         of
- Revision
- File:
- Drawn By:

### Library data of the parts
D1-D4 = BAT42W: Diode Schottky, Vr=30V, If=200mA, Vf=400mV, SOD-123; Manufacturer: Multicomp; Artikkelnr Noca: 10029103; Artikkelnr Simpro: N.A.; Part Number: BAT42W; Manufacturer Part Number: BAT42W; Datasheet: http://www.farnell.com/datasheets/62636.pdf; Footprint Doc: SOD-123; LatestRevisionDate: 2011-10-10; Pin Count: 2; Publisher: Nordic Semiconductor; Published: 2011-10-10; Value: BAT42W; Note: Diode; Supplier: Farnell; Supplier part number: 162-1829; 2nd source Supplier: *; 2nd source part number: *
J1-J4 = Pin List 1x2 TH, 1.27mm, N.C.: Pin List 1x2, 1.27mm (50mil), N.C.; Artikkelnr Noca: N.A.; Part Number: Pin List 1x2 TH, 1.27mm, N.C.; Manufacturer: *; Manufacturer Part Number: *; Datasheet: *; Footprint Doc: LIST_1x2_TH_1.27mm_N.C.; LatestRevisionDate: 2015-07-03; Pin Count: 2; Publisher: Nordic Semiconductor; Published: 2015-06-26; Value: Pin List 1x2 1.27mm; Note: *; Supplier: *; Supplier part number: *; 2nd source Supplier: *; 2nd source part number: *; Artikkelnr Simpro: N.A.
Q1-Q4 = PMV31XN: N-channel TrenchMOS FET; Manufacturer: NXP; 2nd source part number: 1081481RL; Note: 20V; Artikkelnr Noca: N.A.; Part Number: PMV31XN; Manufacturer Part Number: PMV31XN; Datasheet: http://www.nxp.com/documents/data_sheet/PMV31XN.pdf; Footprint Doc: SOT23; LatestRevisionDate: 2015-06-24; Publisher: Nordic Semiconductor; Published: 2015-06-24; Value: PMV31XN; Supplier: Digi-Key; Supplier part number: 568-2354-2-ND; 2nd source Supplier: Farnell; Artikkelnr Simpro: N.A.
R2 R3 R6 R7 = R0402-100: Resistor, ±1%, 0.063W; Note: Chip Res 1%; Artikkelnr Noca: 27049049; Artikkelnr Simpro: N.A.; Value Ohm: 100; Part Number: R0402-100; Manufacturer: *; Manufacturer Part Number: *; Datasheet: *; Footprint Doc: 0402; LatestRevisionDate: 2009-11-23; Pin Count: 2; Publisher: Nordic Semiconductor; Published: 2009-05-08; Value: 100R; Supplier: Farnell; Supplier part number: 173-8837; 2nd source Supplier: *; 2nd source part number: *
R4 R5 R8 R9 = R0402-10k: as R12 on sheet pca20017_misc; Part Number: R0402-10k; Manufacturer: *; Manufacturer Part Number: *; Datasheet: *; Footprint Doc: 0402; LatestRevisionDate: 2009-11-23; Pin Count: 2; Publisher: Nordic Semiconductor; Published: 2009-05-08; Value: 10k; Supplier: Farnell; Supplier part number: 173-8864; 2nd source Supplier: *; 2nd source part number: *

## Nets that join several sheets
GND: pca20017_mcu (18 pins), pca20017_misc (9 pins), pca20017_sensors (29 pins), pca20017_power (14 pins), pca20017_motors (8 pins)
V_BAT: pca20017_sensors (R24.2 R29.2 R30.1), pca20017_power (BAT.1 C17.1 U4.2 U4.3), pca20017_motors (8 pins)
VBUS: pca20017_misc (C20.2 C21.2 J6.1), pca20017_power (D6.1)
VDD_nRF: pca20017_mcu (6 pins), pca20017_misc (12 pins), pca20017_sensors (23 pins), pca20017_power (C14.2 C15.2 R36.2 U7.5)
BAT_ALRT: pca20017_mcu (U1.10), pca20017_sensors (R29.1 TP13.1 U5.5)
INT_IMU: pca20017_mcu (U1.14), pca20017_sensors (TP15.1 U2.12)
LED1_BLUE: pca20017_mcu (U1.24), pca20017_misc (R15.1 R15B.1 SB1.2)
LED1_GREEN: pca20017_mcu (U1.22), pca20017_misc (R11.1 R11B.1)
LED1_RED: pca20017_mcu (U1.23), pca20017_misc (R10.1 R10B.1)
LED2_BLUE: pca20017_mcu (U1.42), pca20017_misc (R18.1 R18B.1)
LED2_GREEN: pca20017_mcu (U1.43), pca20017_misc (R17.1 R17B.1)
LED2_RED: pca20017_mcu (U1.41), pca20017_misc (R16.1 R16B.1)
LED3_BLUE: pca20017_mcu (U1.38), pca20017_misc (R32.1 R32B.1), pca20017_sensors (SB3.1)
LED3_GREEN: pca20017_mcu (U1.39), pca20017_misc (R31.1 R31B.1), pca20017_sensors (SB4.1)
LED3_RED: pca20017_mcu (U1.37), pca20017_misc (R28.1 R28B.1), pca20017_sensors (SB2.1)
LED4_BLUE: pca20017_mcu (U1.29), pca20017_misc (R35.1 R35B.1)
LED4_GREEN: pca20017_mcu (U1.27), pca20017_misc (R34.1 R34B.1)
LED4_RED: pca20017_mcu (U1.28), pca20017_misc (R33.1 R33B.1)
MOTOR1: pca20017_mcu (U1.17), pca20017_motors (R2.1)
MOTOR2: pca20017_mcu (U1.18), pca20017_motors (R3.1)
MOTOR3: pca20017_mcu (U1.19), pca20017_motors (R6.1)
MOTOR4: pca20017_mcu (U1.20), pca20017_motors (R7.1)
NFC1: pca20017_mcu (U1.11), pca20017_misc (C27.1)
NFC2: pca20017_mcu (U1.12), pca20017_misc (C28.2)
PM_CH_EN: pca20017_mcu (U1.5), pca20017_power (R36.1 TP9.1 U4.4)
PM_CHG: pca20017_mcu (U1.4), pca20017_power (TP8.1 U4.9)
PM_EN1: pca20017_mcu (U1.8), pca20017_power (TP12.1 U4.6)
PM_EN2: pca20017_mcu (U1.7), pca20017_power (TP11.1 U4.5)
PM_ISET: pca20017_mcu (U1.6), pca20017_power (R20.1 U4.16)
PM_PGOOD: pca20017_mcu (U1.9), pca20017_power (TP10.1 U4.7)
SCL: pca20017_mcu (U1.16), pca20017_misc (R13.1), pca20017_sensors (5 pins)
SDA: pca20017_mcu (U1.15), pca20017_misc (R14.1), pca20017_sensors (5 pins)
SWDCLK: pca20017_mcu (U1.25), pca20017_misc (SWD.4)
SWDIO: pca20017_mcu (U1.26), pca20017_misc (SWD.2)
SWITCH_0: pca20017_mcu (U1.40), pca20017_misc (R25.2 SW1.1)
SWO: pca20017_mcu (U1.21), pca20017_misc (SWD.6)